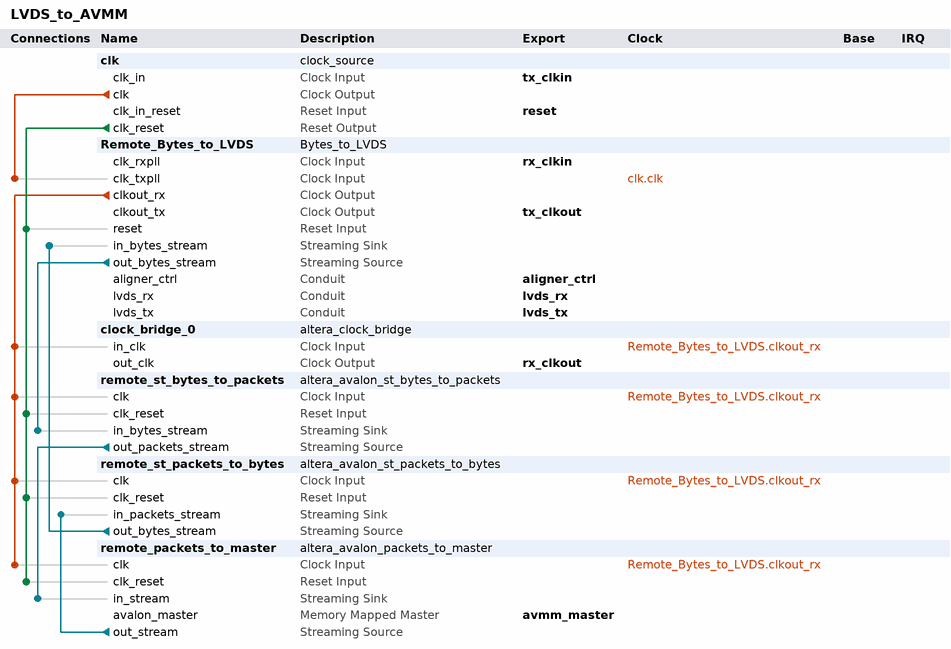
[diagram p0: system contents]
# Platform Designer (Qsys) system LVDS_to_AVMM, Cyclone V 5CSXFC6D6F31C7
# Parameters at their usual value, and those the tool derives, are not listed.
package require -exact qsys 15.0
create_system LVDS_to_AVMM
set_project_property DEVICE_FAMILY {Cyclone V}
set_project_property DEVICE 5CSXFC6D6F31C7

add_instance clk clock_source 15.0
set_instance_parameter_value clk clockFrequency 50000000

add_instance Remote_Bytes_to_LVDS Bytes_to_LVDS 1.0
set_instance_parameter_value Remote_Bytes_to_LVDS PT_PCFIFO false
set_instance_parameter_value Remote_Bytes_to_LVDS PT_SLAVE true
set_instance_parameter_value Remote_Bytes_to_LVDS P_ALIGNSEQ0 0
set_instance_parameter_value Remote_Bytes_to_LVDS P_ALIGNSEQ1 0
set_instance_parameter_value Remote_Bytes_to_LVDS P_DEV_FAMILY 0
set_instance_parameter_value Remote_Bytes_to_LVDS P_OOSCNTR 8
set_instance_parameter_value Remote_Bytes_to_LVDS P_SLAVE 1

add_instance clock_bridge_0 altera_clock_bridge 15.0
set_instance_parameter_value clock_bridge_0 DERIVED_CLOCK_RATE 0
set_instance_parameter_value clock_bridge_0 EXPLICIT_CLOCK_RATE 0

add_instance remote_st_bytes_to_packets altera_avalon_st_bytes_to_packets 15.0
set_instance_parameter_value remote_st_bytes_to_packets CHANNEL_WIDTH 8
set_instance_parameter_value remote_st_bytes_to_packets ENCODING 0

add_instance remote_st_packets_to_bytes altera_avalon_st_packets_to_bytes 15.0
set_instance_parameter_value remote_st_packets_to_bytes CHANNEL_WIDTH 8
set_instance_parameter_value remote_st_packets_to_bytes ENCODING 0

add_instance remote_packets_to_master altera_avalon_packets_to_master 15.0
set_instance_parameter_value remote_packets_to_master EXPORT_MASTER_SIGNALS 0
set_instance_parameter_value remote_packets_to_master FAST_VER 1
set_instance_parameter_value remote_packets_to_master FIFO_DEPTHS 4

# connections
add_connection clk.clk Remote_Bytes_to_LVDS.clk_txpll clock
add_connection Remote_Bytes_to_LVDS.clkout_rx clock_bridge_0.in_clk clock
add_connection Remote_Bytes_to_LVDS.clkout_rx remote_packets_to_master.clk clock
add_connection Remote_Bytes_to_LVDS.clkout_rx remote_st_bytes_to_packets.clk clock
add_connection Remote_Bytes_to_LVDS.clkout_rx remote_st_packets_to_bytes.clk clock
add_connection clk.clk_reset Remote_Bytes_to_LVDS.reset reset
add_connection clk.clk_reset remote_packets_to_master.clk_reset reset
add_connection clk.clk_reset remote_st_bytes_to_packets.clk_reset reset
add_connection clk.clk_reset remote_st_packets_to_bytes.clk_reset reset
add_connection Remote_Bytes_to_LVDS.out_bytes_stream remote_st_bytes_to_packets.in_bytes_stream avalon_streaming
add_connection remote_packets_to_master.out_stream remote_st_packets_to_bytes.in_packets_stream avalon_streaming
add_connection remote_st_bytes_to_packets.out_packets_stream remote_packets_to_master.in_stream avalon_streaming
add_connection remote_st_packets_to_bytes.out_bytes_stream Remote_Bytes_to_LVDS.in_bytes_stream avalon_streaming

# exported interfaces
add_interface aligner_ctrl conduit end
set_interface_property aligner_ctrl EXPORT_OF Remote_Bytes_to_LVDS.aligner_ctrl
add_interface avmm_master avalon master
set_interface_property avmm_master EXPORT_OF remote_packets_to_master.avalon_master
add_interface lvds_rx conduit end
set_interface_property lvds_rx EXPORT_OF Remote_Bytes_to_LVDS.lvds_rx
add_interface lvds_tx conduit end
set_interface_property lvds_tx EXPORT_OF Remote_Bytes_to_LVDS.lvds_tx
add_interface reset reset sink
set_interface_property reset EXPORT_OF clk.clk_in_reset
add_interface rx_clkin clock sink
set_interface_property rx_clkin EXPORT_OF Remote_Bytes_to_LVDS.clk_rxpll
add_interface rx_clkout clock source
set_interface_property rx_clkout EXPORT_OF clock_bridge_0.out_clk
add_interface tx_clkin clock sink
set_interface_property tx_clkin EXPORT_OF clk.clk_in
add_interface tx_clkout clock source
set_interface_property tx_clkout EXPORT_OF Remote_Bytes_to_LVDS.clkout_tx

set_interconnect_requirement {$system} qsys_mm.clockCrossingAdapter HANDSHAKE
set_interconnect_requirement {$system} qsys_mm.insertDefaultSlave FALSE
set_interconnect_requirement {$system} qsys_mm.maxAdditionalLatency 1

save_system LVDS_to_AVMM.qsys
